# EAGLE design LogiGSM (EAGLE 9.6.2)
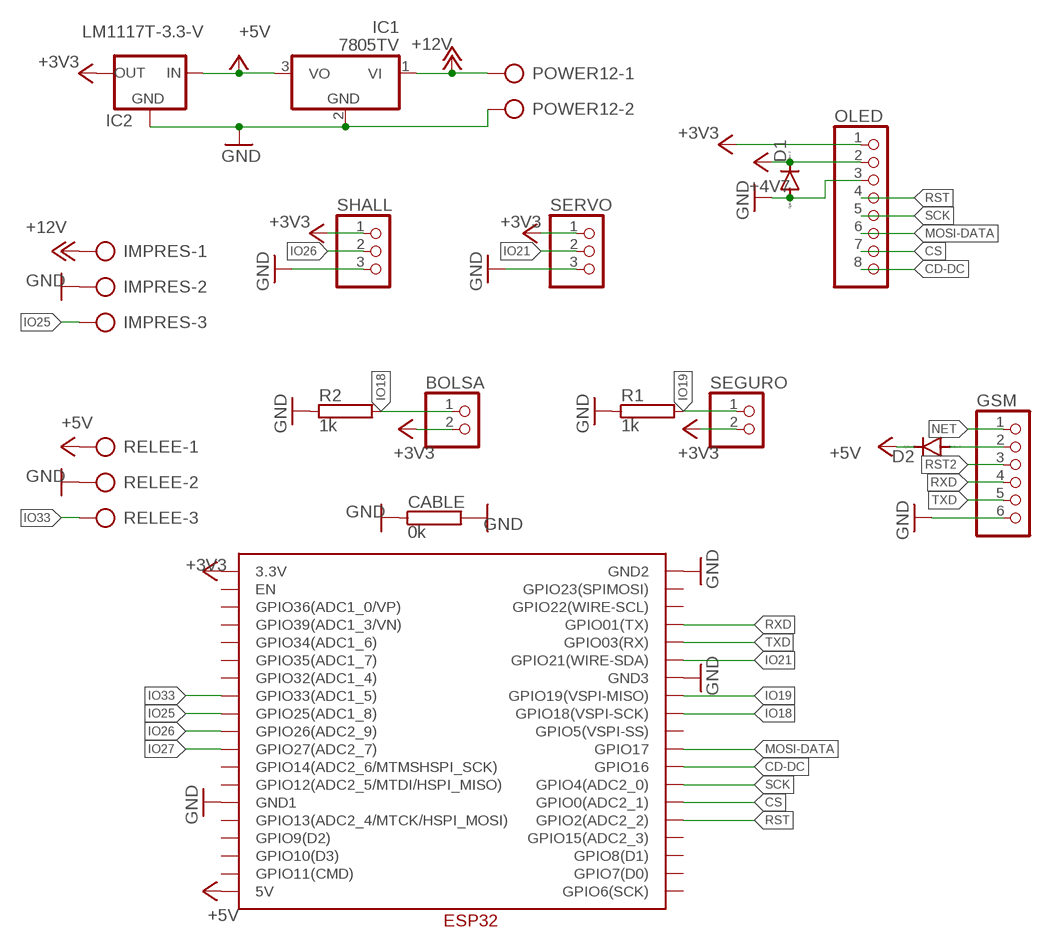
[diagram p0: schematic, sheet 1]

## Parts
BOLSA  PINHD-1X2  [1X02]
CABLE  0k  RRS1/2  [RS1/2]
D1  DIODE-SOD81  [SOD81]
D2  DIODE-SOD81  [SOD81]
GSM  PINHD-1X6  [1X06]
IC1  7805TV  [TO220V]
IC2  LM1117T-3.3-V  [TO220V]
IMPRES  AK500/3  [AK500/3]
OLED  PINHD-1X8  [1X08]
POWER12  AK500/2  [AK500/2]
R1  1k  RRS1/8  [RS1/8]
R2  1k  RRS1/8  [RS1/8]
RELEE  AK500/3  [AK500/3]
SEGURO  PINHD-1X2  [1X02]
SERVO  PINHD-1X3  [1X03]
SHALL  PINHD-1X3  [1X03]
U$1  ESP32WESP32W  [ESP32W]

## Nets
+3V3: BOLSA.2 IC2.2(OUT) OLED.1 SEGURO.2 SERVO.1 SHALL.1 U$1.3.3V
+5V: D1.C D2.C IC1.3(VO) IC2.3(IN) OLED.2 RELEE.1 U$1.5V ; supply symbol labelled +4V7
+12V: IC1.1(VI) IMPRES.1 POWER12.1
CD-DC: OLED.8 U$1.GPIO16
CS: OLED.7 U$1.GPIO0(GPIO0(ADC2_1))
GND: CABLE.1 CABLE.2 D1.A GSM.6 IC1.2(GND) IC2.1(GND) IMPRES.2 OLED.3 POWER12.2 R1.1 R2.1 RELEE.2 SERVO.3 SHALL.3 U$1.GND1 U$1.GND2 U$1.GND3
IO18: BOLSA.1 R2.2 U$1.GPIO18(GPIO18(VSPI-SCK))
IO19: R1.2 SEGURO.1 U$1.GPIO19(GPIO19(VSPI-MISO))
IO21: SERVO.2 U$1.GPIO21(GPIO21(WIRE-SDA))
IO25: IMPRES.3 U$1.GPIO25(GPIO25(ADC1_8))
IO26: SHALL.2 U$1.GPIO26(GPIO26(ADC2_9))
IO27: U$1.GPIO27(GPIO27(ADC2_7))
IO33: RELEE.3 U$1.GPIO33(GPIO33(ADC1_5))
MOSI-DATA: OLED.6 U$1.GPIO17
N$1: D2.A GSM.2
NET: GSM.1
RST: OLED.4 U$1.GPIO2(GPIO2(ADC2_2))
RST2: GSM.3
RXD: GSM.4 U$1.TX(GPIO01(TX))
SCK: OLED.5 U$1.GPIO4(GPIO4(ADC2_0))
TXD: GSM.5 U$1.RX(GPIO03(RX))
Unconnected: U$1.CLK(GPIO6(SCK)) U$1.CMD(GPIO11(CMD)) U$1.D2(GPIO9(D2)) U$1.D3(GPIO10(D3)) U$1.EN U$1.GPIO5(GPIO5(VSPI-SS)) U$1.GPIO12(GPIO12(ADC2_5/MTDI/HSPI_MISO)) U$1.GPIO13(GPIO13(ADC2_4/MTCK/HSPI_MOSI)) U$1.GPIO14(GPIO14(ADC2_6/MTMSHSPI_SCK)) U$1.GPIO15(GPIO15(ADC2_3)) U$1.GPIO22(GPIO22(WIRE-SCL)) U$1.GPIO23(GPIO23(SPIMOSI)) U$1.GPIO32(GPIO32(ADC1_4)) U$1.GPIO34(GPIO34(ADC1_6)) U$1.GPIO35(GPIO35(ADC1_7)) U$1.SDI(GPIO8(D1)) U$1.SDO(GPIO7(D0)) U$1.VN(GPIO39(ADC1_3/VN)) U$1.VP(GPIO36(ADC1_0/VP))

## Library data of the parts
BOLSA SEGURO = pinhead:PINHD-1X2: PIN HEADER
CABLE = resistor-power:R: Power Resitor; MF: OHMITE; MPN: RRS1K0E; OC_FARNELL: 1762006; OC_NEWARK: 64K5942
D1 D2 = diode:DIODE-: DIODE
GSM = pinhead:PINHD-1X6: PIN HEADER
IC1 = linear:78*: Positive VOLTAGE REGULATOR Source: http://cache.national.com/ds/LM/LM78L05.pdf http://www.fairchildsemi.com/ds/LM/LM7805.pdf
IC2 = lm1117:LM1117T-*
IMPRES RELEE = con-ptr500:AK500/3: CONNECTOR; OC_FARNELL: unknown; OC_NEWARK: unknown
OLED = pinhead:PINHD-1X8: PIN HEADER
POWER12 = con-ptr500:AK500/2: CONNECTOR; OC_FARNELL: unknown; OC_NEWARK: unknown
R1 R2 = resistor-powerV2:R: Power Resitor; OC_FARNELL: unknown; OC_NEWARK: unknown
SERVO SHALL = pinhead:PINHD-1X3: PIN HEADER
U$1 = ESP32-WROOM2:ESP32W

## Board
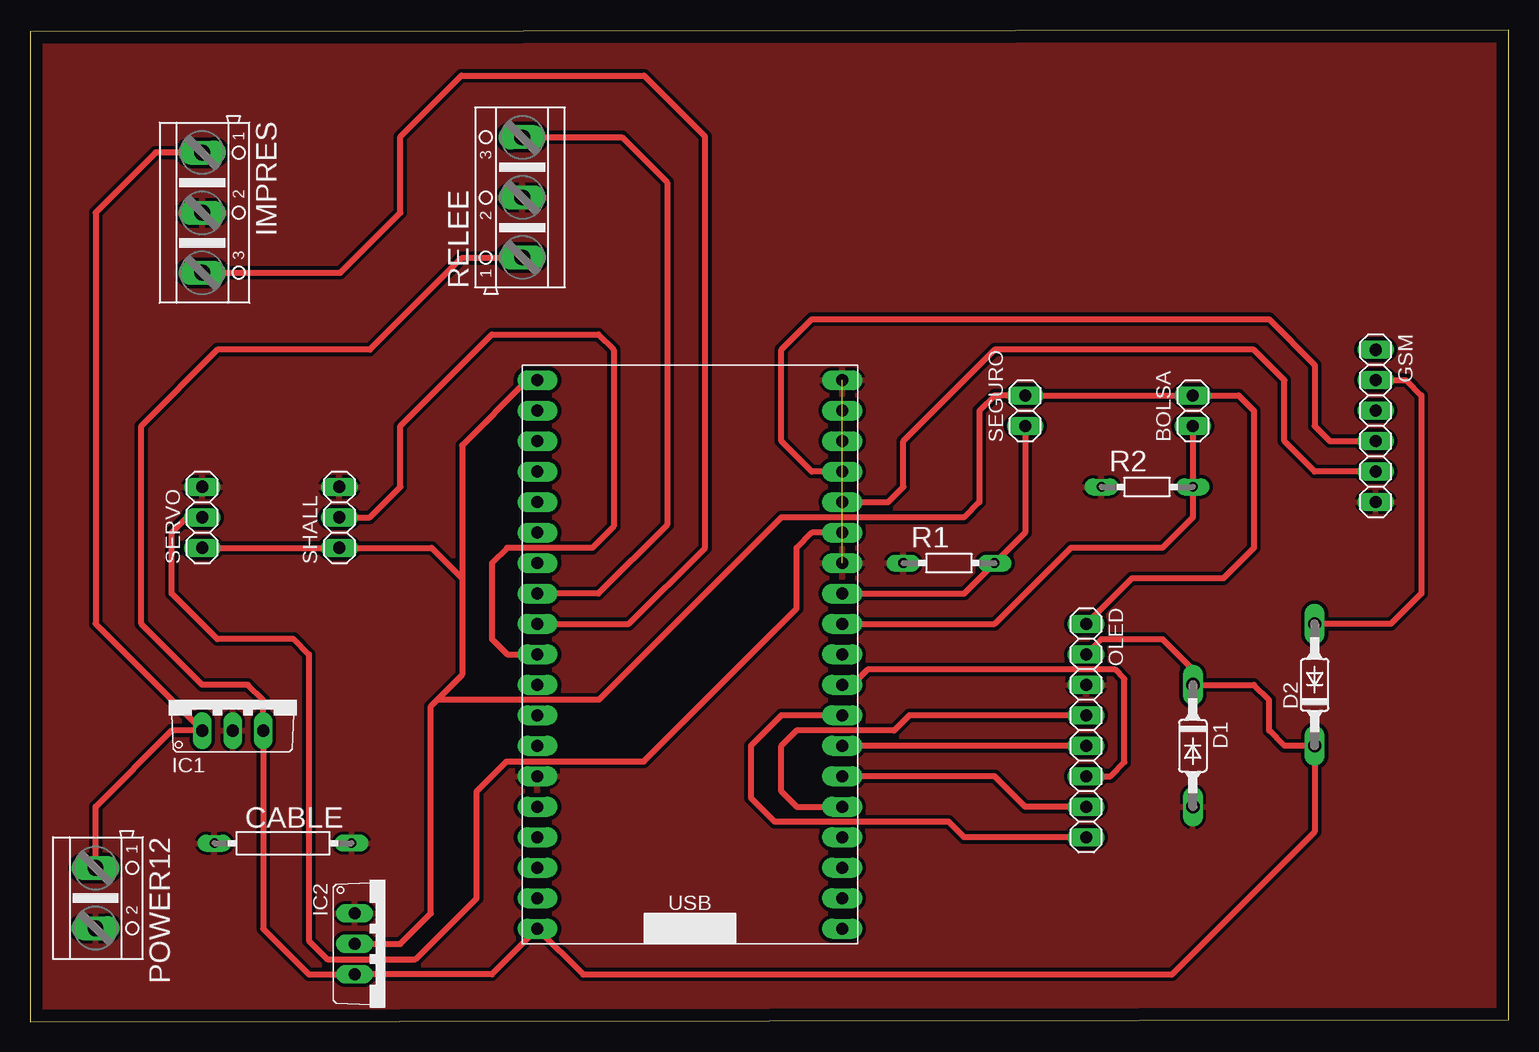
[diagram p1: board, top side]
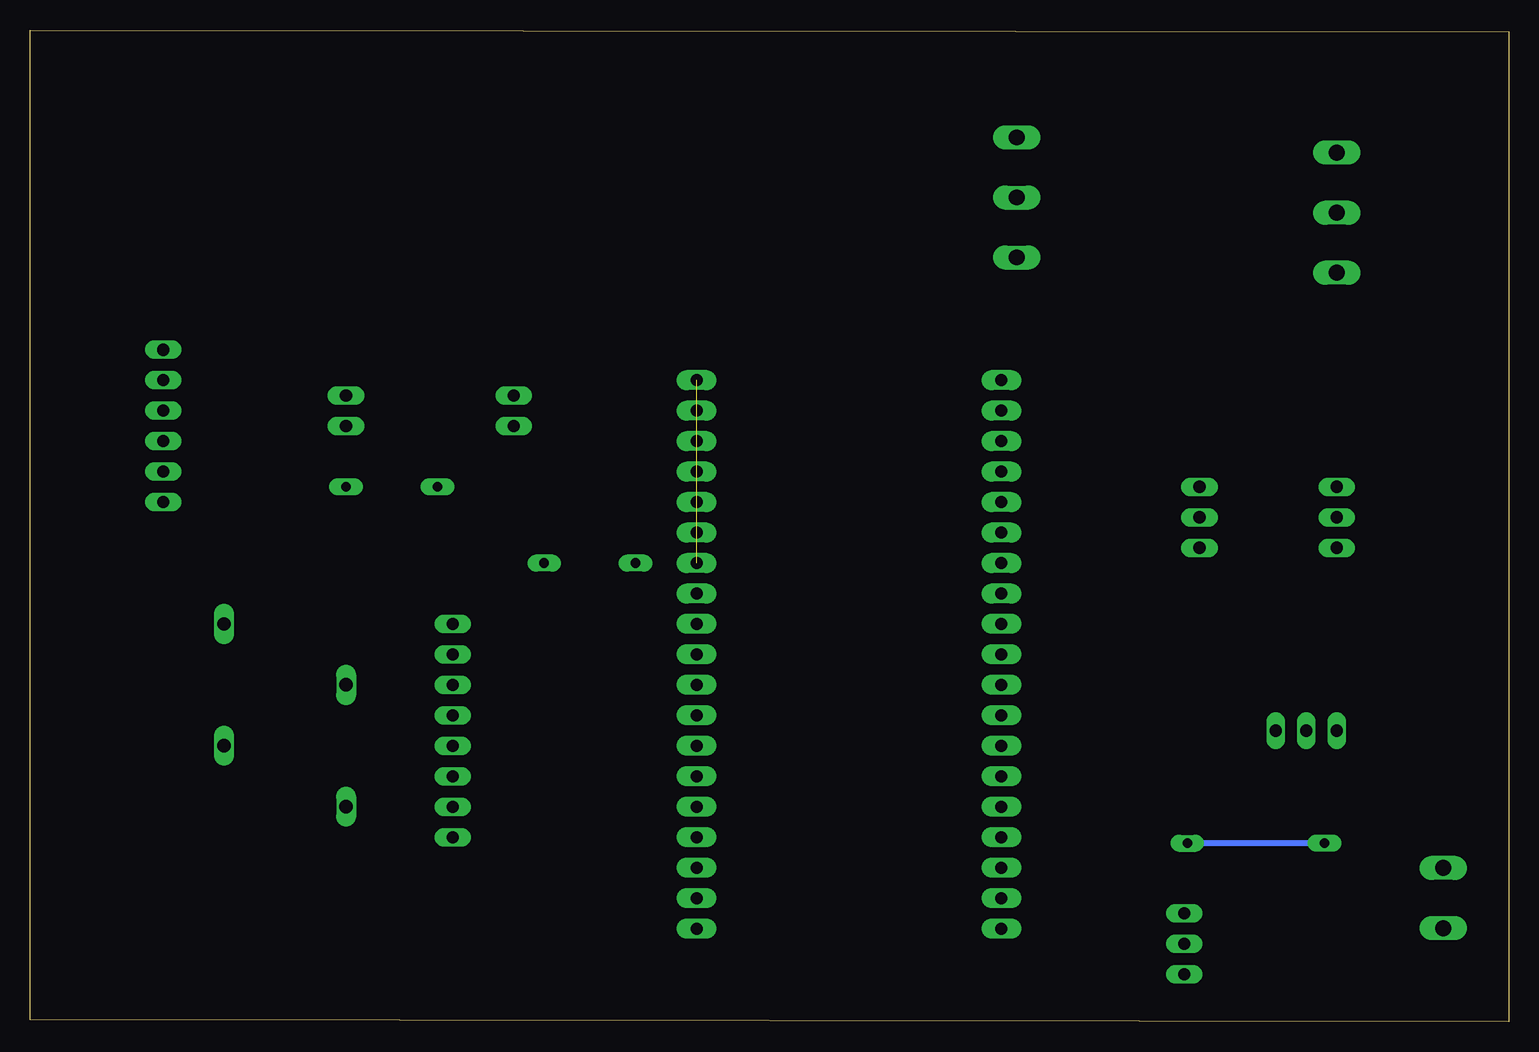
[diagram p2: board, bottom side, seen from below]

Size 123.24 x 82.67 mm. Coordinates in mm from the lower left corner, seen from the top.
Outline: 0,0 123.24,0.13 123.24,82.67 0,82.54 0,0
Copper layers (1*16): Top 0.04mm / dielectric 1.5mm / Bottom 0.04mm
Design rules "default *": minimum track width 0.5mm, minimum drill 0.35mm, track to track 12mil, track to pad 6mil, pad to pad 6mil, via to via 6mil, smd to smd 6mil, copper to edge 40mil, drill to drill 6mil, minimum pad ring 10mil, minimum via ring 8mil, stop-mask expansion 4mil, vias tented up to drill 0mil, thermal gap 10mil

### Footprints (pad centres in the part's own frame; a part is rotated, then mirrored left to right if it is on the bottom)
1X02 = drill 1.016 long: 1 -1.27,0; 2 1.27,0
RS1/2 = drill 0.8 pad 1.4 long: 1 -5.715,0; 2 5.715,0
SOD81 = drill 1.118 long: A 5.08,0; C -5.08,0
1X06 = drill 1.016 long: 1 -6.35,0; 2 -3.81,0; 3 -1.27,0; 4 1.27,0; 5 3.81,0; 6 6.35,0
TO220V = drill 1.016 long: 1 -2.54,-2.54; 2 0,-2.54; 3 2.54,-2.54
AK500/3 = drill 1.321 long: 1 -5.004,0; 2 0,0; 3 5.004,0
1X08 = drill 1.016 long: 1 -8.89,0; 2 -6.35,0; 3 -3.81,0; 4 -1.27,0; 5 1.27,0; 6 3.81,0; 7 6.35,0; 8 8.89,0
AK500/2 = drill 1.321 long: 1 -2.515,0; 2 2.515,0
RS1/8 = drill 0.8 pad 1.4 long: 1 -3.81,0; 2 3.81,0
1X03 = drill 1.016 long: 1 -2.54,0; 2 0,0; 3 2.54,0
ESP32W = drill 1 pad 1.676 long: 3.3V 1.27,46.99; 5V 1.27,1.27; CLK 26.67,1.27; CMD 1.27,3.81; D2 1.27,8.89; D3 1.27,6.35; EN 1.27,44.45; GND1 1.27,13.97; GND2 26.67,46.99; GND3 26.67,31.75; GPIO0 26.67,13.97; GPIO2 26.67,11.43; GPIO4 26.67,16.51; GPIO5 26.67,24.13; GPIO12 1.27,16.51; GPIO13 1.27,11.43; GPIO14 1.27,19.05; GPIO15 26.67,8.89; GPIO16 26.67,19.05; GPIO17 26.67,21.59; GPIO18 26.67,26.67; GPIO19 26.67,29.21; GPIO21 26.67,34.29; GPIO22 26.67,41.91; GPIO23 26.67,44.45; GPIO25 1.27,26.67; GPIO26 1.27,24.13; GPIO27 1.27,21.59; GPIO32 1.27,31.75; GPIO33 1.27,29.21; GPIO34 1.27,36.83; GPIO35 1.27,34.29; RX 26.67,36.83; SDI 26.67,6.35; SDO 26.67,3.81; TX 26.67,39.37; VN 1.27,39.37; VP 1.27,41.91

### Placement (x,y rotation side)
BOLSA  96.9,50.93 90 top
CABLE  21.08,14.86 0 top
D1  96.9,22.99 270 top
D2  107.06,28.07 90 top
GSM  112.14,49.66 270 top
IC1  16.89,26.8 0 top
IC2  29.59,6.48 270 top
IMPRES  14.35,67.44 270 top
OLED  88.01,24.26 270 top
POWER12  5.46,10.29 270 top
R1  76.58,38.23 0 top
R2  93.09,44.58 0 top
RELEE  41.02,68.71 90 top
SEGURO  82.93,50.93 90 top
SERVO  14.35,42.04 90 top
SHALL  25.78,42.04 90 top
U$1  41.02,6.48 0 top

### Tracks (layer width: path | path; a pad name or v marks a point on that pad's centre or on a via)
+3V3
  Top 0.5: U$1.3.3V 41.45,53.47 36.01,48.02 36.01,36.96 | 36.01,36.96 36.01,28.9 33.94,26.83 | OLED.1 91.82,36.96 99.44,36.96 101.98,39.5 101.98,50.93 100.71,52.2 BOLSA.2 SEGURO.2 80.39,52.2 79.12,50.93 79.12,43.31 77.85,42.04 62.61,42.04 47.4,26.83 33.94,26.83 | SERVO.1 SHALL.1 33.47,39.5 36.01,36.96 | IC2.2 30.86,6.48 33.4,9.02 33.4,26.29 33.94,26.83
+5V
  Top 0.5: RELEE.1 40.95,63.63 35.94,63.63 28.32,56.01 15.62,56.01 9.27,49.66 9.27,33.15 14.35,28.07 18.16,28.07 19.43,26.8 IC1.3 19.43,7.75 23.24,3.94 IC2.3 38.48,3.94 U$1.5V 46.1,3.94 95.17,3.94 107.06,15.83 D2.C 104.52,22.99 103.25,24.26 103.25,26.8 101.98,28.07 D1.C 96.9,29.34 94.36,31.88 89.28,31.88 OLED.2
+12V
  Top 0.5: IMPRES.1 10.46,72.44 5.46,67.44 5.46,33.15 6.73,31.88
  Top 0.508: POWER12.1 5.46,17.91 11.81,24.26 IC1.1 6.73,31.88
CD-DC
  Top 0.5: OLED.8 77.85,15.37 76.55,16.67 62.06,16.67 60.07,18.65 60.07,22.99 62.61,25.53 U$1.GPIO16
CS
  Top 0.5: OLED.7 82.93,17.91 80.39,20.45 U$1.GPIO0
GND  (1 unrouted)
  Bottom 0.5: CABLE.1 CABLE.2
  pour Top: 1.14,82.04 1.14,0.25 122.3,0.25 122.3,82.04
IO18
  Top 0.5: U$1.GPIO18 80.39,33.15 86.74,39.5 94.36,39.5 96.9,42.04 R2.2 BOLSA.1
IO19
  Top 0.5: U$1.GPIO19 77.85,35.69 R1.2 82.93,40.77 SEGURO.1
IO21
  Top 0.5: SERVO.2 13.08,42.04 11.81,40.77 11.81,35.69 15.62,31.88 21.97,31.88 23.24,30.61 23.24,6.73 24.77,5.21 32.13,5.21 37.21,10.29 37.21,19.18 39.72,21.69 51.15,21.69 63.88,34.42 63.88,39.5 65.15,40.77 U$1.GPIO21
IO25
  Top 0.5: U$1.GPIO25 49.91,33.15 56.26,39.5 56.26,73.79 51.18,78.87 35.94,78.87 30.86,73.79 30.86,67.44 25.86,62.43 IMPRES.3
IO26
  Top 0.5: SHALL.2 28.32,42.04 30.86,44.58 30.86,49.66 38.48,57.28 47.37,57.28 48.64,56.01 48.64,41.27 46.86,39.5 39.75,39.5 38.48,38.23 38.48,31.88 39.75,30.61 U$1.GPIO26
IO33
  Top 0.5: U$1.GPIO33 47.37,35.69 53.09,41.4 53.09,69.98 49.35,73.71 RELEE.3
MOSI-DATA
  Top 0.5: OLED.6 90.04,20.45 91.21,21.61 91.21,28.55 90.42,29.34 69.8,29.34 68.53,28.07 U$1.GPIO17
N$1
  Top 0.5: GSM.2 114.68,53.47 115.95,52.2 115.95,35.69 113.41,33.15 D2.A
RST
  Top 0.5: OLED.4 73.28,25.53 72.01,24.26 63.88,24.26 62.61,22.99 62.61,19.18 63.88,17.91 U$1.GPIO2
RXD
  Top 0.5: U$1.TX 65.15,45.85 62.61,48.39 62.61,56.01 65.15,58.55 103.25,58.55 107.06,54.74 107.06,49.66 108.33,48.39 GSM.4
SCK
  Top 0.5: OLED.5 U$1.GPIO4
TXD
  Top 0.5: U$1.RX 71.5,43.31 72.77,44.58 72.77,48.39 80.39,56.01 101.98,56.01 104.52,53.47 104.52,48.39 107.06,45.85 GSM.5